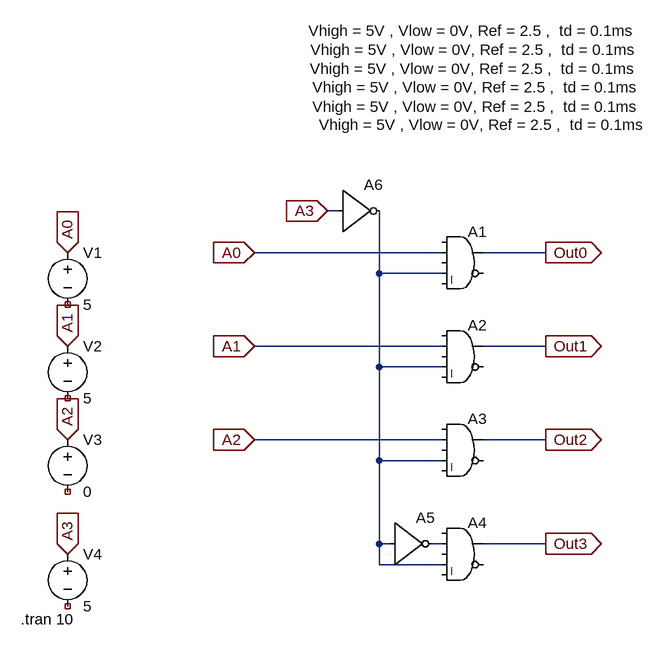
[diagram p0: schematic Max_0N.asc]
Max_0N.asc, the LTspice schematic file:
Version 4
SHEET 1 880 680
WIRE -32 0 -48 0
WIRE 128 64 -160 64
WIRE 288 64 192 64
WIRE 32 96 32 0
WIRE 128 96 32 96
WIRE 128 208 -160 208
WIRE 288 208 192 208
WIRE 32 240 32 96
WIRE 128 240 32 240
WIRE 128 352 -160 352
WIRE 288 352 192 352
WIRE 32 384 32 240
WIRE 128 384 32 384
WIRE 32 512 32 384
WIRE 48 512 32 512
WIRE 128 512 112 512
WIRE 288 512 192 512
WIRE 32 544 32 512
WIRE 128 544 32 544
FLAG -160 64 A0
IOPIN -160 64 In
FLAG -160 208 A1
IOPIN -160 208 In
FLAG -160 352 A2
IOPIN -160 352 In
FLAG -48 0 A3
IOPIN -48 0 In
FLAG 288 64 Out0
IOPIN 288 64 Out
FLAG 288 208 Out1
IOPIN 288 208 Out
FLAG 288 352 Out2
IOPIN 288 352 Out
FLAG 288 512 Out3
IOPIN 288 512 Out
FLAG -448 64 A0
IOPIN -448 64 In
FLAG -448 208 A1
IOPIN -448 208 In
FLAG -448 352 A2
IOPIN -448 352 In
FLAG -448 528 A3
IOPIN -448 528 In
SYMBOL Digital\\and 160 16 R0
WINDOW 3 -235 -235 Left 2
SYMATTR InstName A1
SYMATTR Value Vhigh = 5V , Vlow = 0V, Ref = 2.5 ,  td = 0.1ms
SYMBOL Digital\\and 160 160 R0
WINDOW 3 -231 -350 Left 2
SYMATTR InstName A2
SYMATTR Value Vhigh = 5V , Vlow = 0V, Ref = 2.5 ,  td = 0.1ms
SYMBOL Digital\\and 160 304 R0
WINDOW 3 -231 -464 Left 2
SYMATTR InstName A3
SYMATTR Value Vhigh = 5V , Vlow = 0V, Ref = 2.5 ,  td = 0.1ms
SYMBOL Digital\\and 160 464 R0
WINDOW 3 -237 -741 Left 2
SYMATTR InstName A4
SYMATTR Value Vhigh = 5V , Vlow = 0V, Ref = 2.5 ,  td = 0.1ms
SYMBOL Digital\\inv 48 448 R0
WINDOW 3 -109 -581 Left 2
SYMATTR InstName A5
SYMATTR Value Vhigh = 5V , Vlow = 0V, Ref = 2.5 ,  td = 0.1ms
SYMBOL Digital\\inv -32 -64 R0
WINDOW 3 -42 -184 Left 2
SYMATTR InstName A6
SYMATTR Value Vhigh = 5V , Vlow = 0V, Ref = 2.5 ,  td = 0.1ms
SYMBOL voltage -448 48 R0
WINDOW 123 0 0 Left 0
WINDOW 39 0 0 Left 0
SYMATTR InstName V1
SYMATTR Value 5
SYMBOL voltage -448 192 R0
WINDOW 123 0 0 Left 0
WINDOW 39 0 0 Left 0
SYMATTR InstName V2
SYMATTR Value 5
SYMBOL voltage -448 336 R0
WINDOW 123 0 0 Left 0
WINDOW 39 0 0 Left 0
SYMATTR InstName V3
SYMATTR Value 0
SYMBOL voltage -448 512 R0
WINDOW 123 0 0 Left 0
WINDOW 39 0 0 Left 0
SYMATTR InstName V4
SYMATTR Value 5
TEXT -520 628 Left 2 !.tran 10

The netlist it stands for:
* Max_0N.asc
A1 0 A0 0 N001 0 0 Out0 0 AND Vhigh = 5V , Vlow = 0V, Ref = 2.5 ,  td = 0.1ms
A2 0 A1 0 N001 0 0 Out1 0 AND Vhigh = 5V , Vlow = 0V, Ref = 2.5 ,  td = 0.1ms
A3 0 A2 0 N001 0 0 Out2 0 AND Vhigh = 5V , Vlow = 0V, Ref = 2.5 ,  td = 0.1ms
A4 0 N002 0 N001 0 0 Out3 0 AND Vhigh = 5V , Vlow = 0V, Ref = 2.5 ,  td = 0.1ms
A5 N001 0 0 0 0 N002 0 0 BUF Vhigh = 5V , Vlow = 0V, Ref = 2.5 ,  td = 0.1ms
A6 A3 0 0 0 0 N001 0 0 BUF Vhigh = 5V , Vlow = 0V, Ref = 2.5 ,  td = 0.1ms
V1 A0 NC_01 5
V2 A1 NC_02 5
V3 A2 NC_03 0
V4 A3 NC_04 5
.tran 10
.backanno
.end